# Altium schematic sheet REG5-3.3.SchDoc
size A4; SheetNumber: 1; SheetTotal: 1
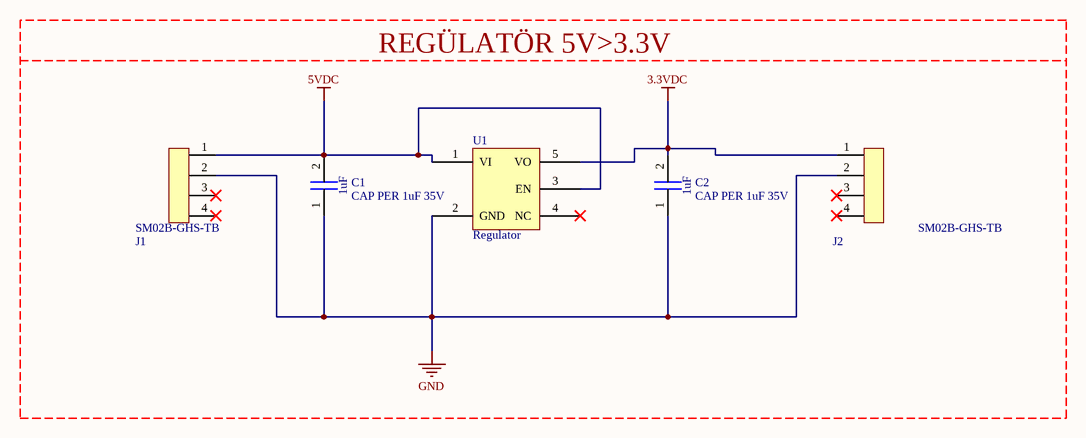
[diagram p0: REG5-3.3.SchDoc]

## Parts
C1  CAP PER 1uF 35V  [CAP_0805]
C2  CAP PER 1uF 35V  [CAP_0805]
J1  SM02B-GHS-TB  [SM02B-GHS-TB(LF)(SN)]  (value not drawn)
J2  SM02B-GHS-TB  [SM02B-GHS-TB(LF)(SN)]  (value not drawn)
U1  Regulator  [SOT23-5]

## Blocks framed on the sheet
REGÜLATÖR 5V>3.3V: C1 C2 J1 J2 U1

## Nets
3.3VDC: C2.2 J2.1 U1.5(VO)
5VDC: C1.2 J1.1 U1.1(VI) U1.3(EN)
GND: C1.1 C2.1 J1.2 J2.2 U1.2(GND)

Not connected (* = marked no-connect by the designer): J1 3* 4*; J2 3* 4*; U1 4(NC)*

## Notes on the sheet
- (in symbol CAP PER 1uF 35V) 1uF

## Library data of the parts
C1 C2 = CAP PER 1uF 35V: Tantalum Capacitor, Polarized, Tantalum (solid Polymer), 35V, 20% +Tol, 20% -Tol, 1uF, Surface Mount, 0805; Manufacturer: Vishay; Manufacturer Part Number: T58W9105M035C0500; Value: 1µF; ESR (Equivalent Series Resistance): 500mΩ; Leakage Current: 3.5µA; Ripple Current: 283mA; Supplier: Farnell; Supplier Part Number: 3297993; RoHS: Compliant; Category: Tantalum Capacitors; Stock: 4000; Pricing: 4000=0,221 (EUR); China RoHS: Compliant; Height: 900µm; Length: 2mm; Lifecycle Status: Production; Max Operating Temperature: 105°C; Min Operating Temperature: -55°C; Mounting Technology: Surface Mount; Number of Terminals: 2; Packaging: Cut Tape; Schedule B: 8532210050, 8532210050|8532210050|8532210050|8532210050|8532210050; Voltage Rating (DC): 35V; Width: 1.25mm; ComponentLink1URL: https://datasheet.octopart.com:443/T58W9105M035C0500-Vishay-datasheet-182138793.pdf?src-supplier=IHS; ComponentLink1Description: https://datasheet.octopart.com:443/T58W9105M035C0500-Vishay-datasheet-182138793.pdf?src-supplier=IHS; ComponentLink2URL: https://datasheet.octopart.com:443/T58W9105M035C0500-Vishay-datasheet-181963491.pdf?src-supplier=Newark; ComponentLink2Description: https://datasheet.octopart.com:443/T58W9105M035C0500-Vishay-datasheet-181963491.pdf?src-supplier=Newark; ComponentLink3URL: https://datasheet.octopart.com:443/T58W9105M035C0500-Vishay-datasheet-76796261.pdf?src-supplier=element14+APAC; ComponentLink3Description: https://datasheet.octopart.com:443/T58W9105M035C0500-Vishay-datasheet-76796261.pdf?src-supplier=element14+APAC; ComponentLink4URL: https://datasheet.octopart.com:443/T58W9105M035C0500-Vishay-datasheet-95510002.pdf?src-supplier=Future+Electronics; ComponentLink4Description: https://datasheet.octopart.com:443/T58W9105M035C0500-Vishay-datasheet-95510002.pdf?src-supplier=Future+Electronics; ComponentLink5URL: http://sigma.octopart.com:80/rohs_statement/Vishay-company-15.pdf?src-supplier=Compliance+Statements; ComponentLink5Description: http://sigma.octopart.com:80/rohs_statement/Vishay-company-15.pdf?src-supplier=Compliance+Statements
J1 J2 = SM02B-GHS-TB: Conn Shrouded Header HDR 2 POS 1.25mm Solder RA Side Entry SMD T/R; Manufacturer: JST; Connector Type: Male Pin, Outer Shroud Contact; Contact Resistance: 50mΩ; Current Rating: 1A; Dielectric Material: Polyamide; Insulation Resistance: 100MΩ; Number of Contacts: 2; Pitch: 1.2446mm; Voltage Rating: 50V; Supplier: Arrow Electronics; Supplier Part Number: SM02B-GHS-TB (LF)(SN); Manufacturer Part Number: SM02B-GHS-TB(LF)(SN); RoHS: Compliant; Category: Headers and Wire Housings; Stock: 12500; Pricing: 2500=0,1022, 5000=0,099, 10000=0,097 (USD); China RoHS: Compliant; Color: Natural; Contact Gender: Male; Contact Material: Copper, Tin; Contact Plating: Tin; Fastening Type: Latch, Ramp; Height: 4.25mm; Housing Color: Natural; Housing Material: Nylon; Lead Free: Lead Free; Lifecycle Status: Production; Max Operating Temperature: 85°C; Min Operating Temperature: -25°C; Mounting Technology: Surface Mount; Pins: 2; Number of Positions: 2; Number of Rows: 1; REACH SVHC: Yes; Terminal Pitch: 1.25mm; Termination: Solder; ComponentLink1URL: https://datasheet.octopart.com:443/SM02B-GHS-TB%28LF%29%28SN%29-JST-datasheet-151632282.pdf?src-supplier=Upverter; ComponentLink1Description: https://datasheet.octopart.com:443/SM02B-GHS-TB%28LF%29%28SN%29-JST-datasheet-151632282.pdf?src-supplier=Upverter; ComponentLink2URL: https://datasheet.octopart.com:443/SM02B-GHS-TB%28LF%29%28SN%29-JST-datasheet-10511.pdf?src-supplier=Farnell; ComponentLink2Description: https://datasheet.octopart.com:443/SM02B-GHS-TB%28LF%29%28SN%29-JST-datasheet-10511.pdf?src-supplier=Farnell; ComponentLink3URL: https://datasheet.octopart.com:443/SM02B-GHS-TB-%28LF%29%28SN%29-JST-datasheet-28358378.pdf?src-supplier=TME; ComponentLink3Description: https://datasheet.octopart.com:443/SM02B-GHS-TB-%28LF%29%28SN%29-JST-datasheet-28358378.pdf?src-supplier=TME; ComponentLink4URL: https://datasheet.octopart.com:443/SM02B-GHS-TB%28LF%29%28SN%29-JST-datasheet-13551083.pdf?src-supplier=Future+Electronics; ComponentLink4Description: https://datasheet.octopart.com:443/SM02B-GHS-TB%28LF%29%28SN%29-JST-datasheet-13551083.pdf?src-supplier=Future+Electronics; ComponentLink5URL: https://datasheet.octopart.com:443/SM02B-GHS-TB%28LF%29%28SN%29-JST-datasheet-12527556.pdf?src-supplier=Future+Electronics; ComponentLink5Description: https://datasheet.octopart.com:443/SM02B-GHS-TB%28LF%29%28SN%29-JST-datasheet-12527556.pdf?src-supplier=Future+Electronics; ComponentLink6URL: https://datasheet.octopart.com:443/SM02B-GHS-TB%28LF%29%28SN%29-JST-datasheet-137194309.pdf?src-supplier=Component+Distributors+Inc.; ComponentLink6Description: https://datasheet.octopart.com:443/SM02B-GHS-TB%28LF%29%28SN%29-JST-datasheet-137194309.pdf?src-supplier=Component+Distributors+Inc.
U1 = MIC5317-3.3YM5-TR: Fixed LDO Voltage Regulator, 2.5V to 6V, 155mV drop, 3.3V/150mA out, SOT-23-5; Manufacturer: Microchip; Min Current Limit: 200mA; Number of Outputs: 1; Output Current: 150mA; Output Voltage: 3.3V; Power Supply Rejection Ratio (PSRR): 70dB; Supplier: Farnell; Supplier Part Number: 2920683; Manufacturer Part Number: MIC5317-3.3YM5-TR; RoHS: Compliant; Category: LDO Voltage Regulators; Stock: 8681; Pricing: 1=0,217, 25=0,175, 100=0,158, 3000=0,156 (EUR); Projected EOL Date: 2039-09-30; Country of Assembly: Thailand; Country of Fabrication: United States of America; Country of Origin: Thailand; Dropout Voltage: 155mV; Export Control Classification Number (ECCN) Code: EAR99; Harmonized Tariff Schedule (HTS) Code: 8542.39.0060; Lifecycle Status: Production; Max Supply Voltage: 6V; Max Operating Temperature: 125°C; Min Input Voltage: 2.5V; Min Operating Temperature: -40°C; Mounting Technology: Surface Mount; Pins: 5; Number of Regulators: 1; Output Type: Fixed; Schedule B: 8542390000, 8542390000|8542390000|8542390000|8542390000|8542390000; ComponentLink1URL: https://datasheet.octopart.com:443/MIC5317-3.3YM5-TR-Microchip-datasheet-137319728.pdf?src-supplier=Newark; ComponentLink1Description: https://datasheet.octopart.com:443/MIC5317-3.3YM5-TR-Microchip-datasheet-137319728.pdf?src-supplier=Newark; ComponentLink2URL: https://datasheet.octopart.com:443/MIC5317-3.3YM5-TR-Microchip-datasheet-26354330.pdf?src-supplier=element14+APAC; ComponentLink2Description: https://datasheet.octopart.com:443/MIC5317-3.3YM5-TR-Microchip-datasheet-26354330.pdf?src-supplier=element14+APAC; ComponentLink3URL: https://datasheet.octopart.com:443/MIC5317-3.3YM5-TR-Microchip-datasheet-519557.pdf?src-supplier=Future+Electronics; ComponentLink3Description: https://datasheet.octopart.com:443/MIC5317-3.3YM5-TR-Microchip-datasheet-519557.pdf?src-supplier=Future+Electronics; ComponentLink4URL: http://sigma.octopart.com:80/188454461/materials_sheet/Microchip-MIC5317-3.3YM5-TR.pdf?src-supplier=Compliance+Statements; ComponentLink4Description: http://sigma.octopart.com:80/188454461/materials_sheet/Microchip-MIC5317-3.3YM5-TR.pdf?src-supplier=Compliance+Statements; ComponentLink5URL: http://sigma.octopart.com:80/rohs_statement/Microchip-company-71.pdf?src-supplier=Compliance+Statements; ComponentLink5Description: http://sigma.octopart.com:80/rohs_statement/Microchip-company-71.pdf?src-supplier=Compliance+Statements; ComponentLink6URL: http://sigma.octopart.com:80/reach_statement/Microchip-company-70.pdf?src-supplier=Compliance+Statements; ComponentLink6Description: http://sigma.octopart.com:80/reach_statement/Microchip-company-70.pdf?src-supplier=Compliance+Statements; ComponentLink7URL: http://sigma.octopart.com:80/conflict_mineral_statement/Microchip-company-69.pdf?src-supplier=Compliance+Statements; ComponentLink7Description: http://sigma.octopart.com:80/conflict_mineral_statement/Microchip-company-69.pdf?src-supplier=Compliance+Statements; ComponentLink8URL: http://sigma.octopart.com:80/conflict_mineral_statement/Microchip-company-68.pdf?src-supplier=Compliance+Statements; ComponentLink8Description: http://sigma.octopart.com:80/conflict_mineral_statement/Microchip-company-68.pdf?src-supplier=Compliance+Statements